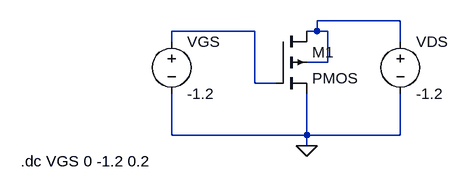
[diagram p0: schematic pmos_90.asc]
pmos_90.asc, the LTspice schematic file:
Version 4.1
SHEET 1 880 680
WIRE 384 80 256 80
WIRE 160 96 32 96
WIRE 256 96 256 80
WIRE 256 96 240 96
WIRE 272 96 256 96
WIRE 32 112 32 96
WIRE 384 112 384 80
WIRE 272 144 272 96
WIRE 272 144 240 144
WIRE 160 176 160 96
WIRE 192 176 160 176
WIRE 32 256 32 192
WIRE 240 256 240 192
WIRE 240 256 32 256
WIRE 384 256 384 192
WIRE 384 256 240 256
WIRE 240 272 240 256
FLAG 240 272 0
SYMBOL pmos4 192 96 R0
SYMATTR InstName M1
SYMATTR Value2 l=90n w=405n
SYMBOL voltage 32 96 R0
SYMATTR InstName VGS
SYMATTR Value -1.2
SYMBOL voltage 384 96 R0
SYMATTR InstName VDS
SYMATTR Value -1.2
TEXT -200 296 Left 2 !.dc VGS 0 -1.2 0.2

The netlist it stands for:
* pmos_90.asc
M1 N001 N002 0 N001 PMOS l=90n w=405n
VGS N002 0 -1.2
VDS N001 0 -1.2
.model NMOS NMOS
.model PMOS PMOS
.lib standard.mos
.dc VGS 0 -1.2 0.2
.backanno
.end